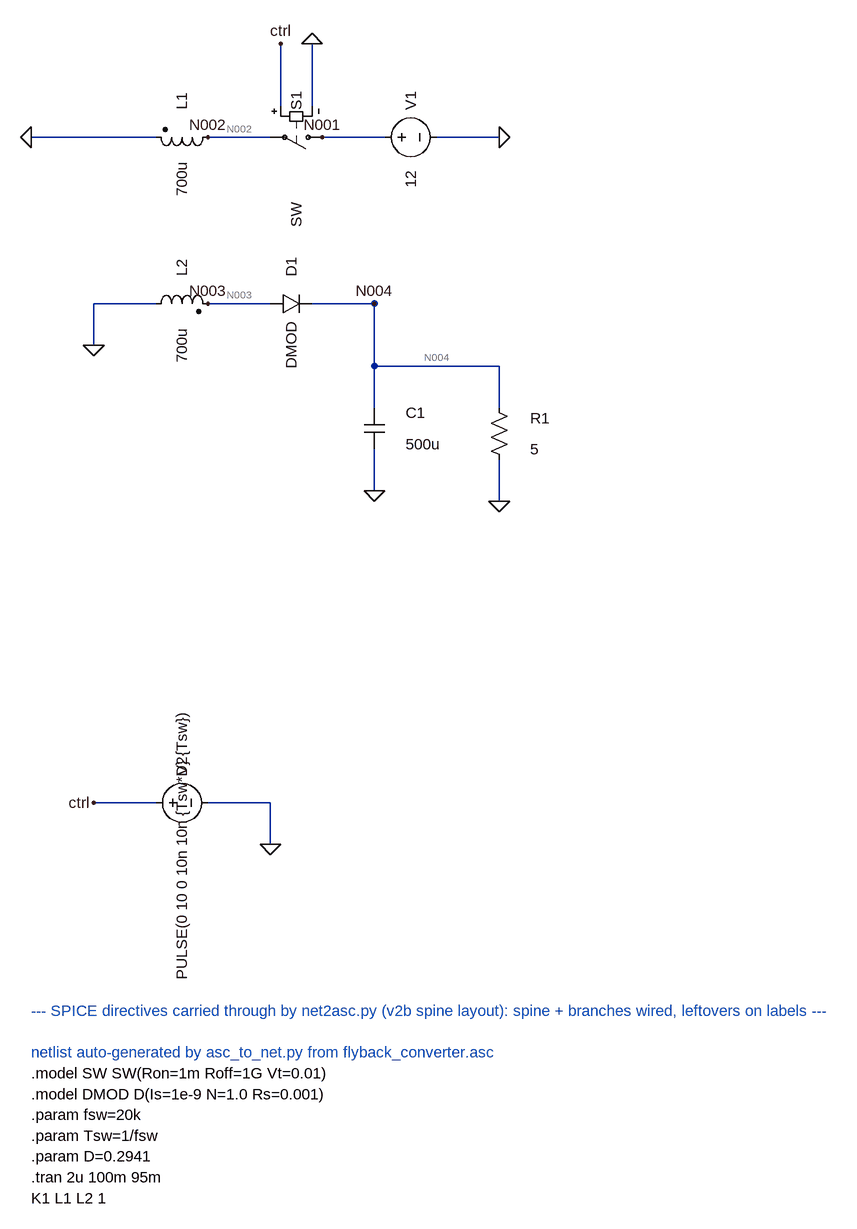
[diagram p0: schematic flyback_converter.asc]
flyback_converter.asc, the LTspice schematic file:
Version 4
SHEET 1 2080 2032
WIRE 160 464 160 528
WIRE 160 464 256 464
WIRE 336 464 432 464
WIRE 496 464 592 464
WIRE 592 464 592 560
WIRE 592 560 592 624
WIRE 592 688 592 752
WIRE 592 464 592 560
WIRE 592 560 784 560
WIRE 784 560 784 624
WIRE 784 704 784 768
WIRE 64 208 160 208
WIRE 160 208 256 208
WIRE 336 208 432 208
WIRE 512 208 608 208
WIRE 448 160 448 64
WIRE 496 160 496 64
WIRE 688 208 784 208
WIRE 160 1232 256 1232
WIRE 336 1232 432 1232
WIRE 432 1232 432 1296
FLAG 160 528 0
FLAG 592 464 N004
FLAG 592 752 0
FLAG 784 768 0
FLAG 64 208 0
FLAG 448 64 ctrl
FLAG 496 64 0
FLAG 784 208 0
FLAG 160 1232 ctrl
FLAG 432 1296 0
FLAG 512 208 N001
FLAG 336 208 N002
FLAG 336 464 N003
SYMBOL ind2 240 480 R270
WINDOW 0 72 56 Center 2
WINDOW 3 -48 56 Center 2
SYMATTR InstName L2
SYMATTR Value 700u
SYMBOL diode 432 480 R270
WINDOW 0 72 32 Center 2
WINDOW 3 -48 32 Center 2
SYMATTR InstName D1
SYMATTR Value DMOD
SYMBOL cap 576 624 R0
WINDOW 0 64 8 Left 2
WINDOW 3 64 56 Left 2
SYMATTR InstName C1
SYMATTR Value 500u
SYMBOL res 768 608 R0
WINDOW 0 64 32 Left 2
WINDOW 3 64 80 Left 2
SYMATTR InstName R1
SYMATTR Value 5
SYMBOL ind2 352 192 R90
WINDOW 0 -40 56 Center 2
WINDOW 3 80 56 Center 2
SYMATTR InstName L1
SYMATTR Value 700u
SYMBOL sw 528 208 R90
WINDOW 0 -56 56 Center 2
WINDOW 3 120 56 Center 2
SYMATTR InstName S1
SYMATTR Value SW
SYMBOL voltage 592 208 R270
WINDOW 0 56 56 Center 2
WINDOW 3 -64 56 Center 2
SYMATTR InstName V1
SYMATTR Value 12
SYMBOL voltage 240 1232 R270
WINDOW 0 56 56 Center 2
WINDOW 3 -64 56 Center 2
SYMATTR InstName V2
SYMATTR Value PULSE(0 10 0 10n 10n {Tsw*D} {Tsw})
TEXT 64 1552 Left 2 ;--- SPICE directives carried through by net2asc.py (v2b spine layout): spine + branches wired, leftovers on labels ---
TEXT 64 1616 Left 2 ;netlist auto-generated by asc_to_net.py from flyback_converter.asc
TEXT 64 1648 Left 2 !.model SW SW(Ron=1m Roff=1G Vt=0.01)
TEXT 64 1680 Left 2 !.model DMOD D(Is=1e-9 N=1.0 Rs=0.001)
TEXT 64 1712 Left 2 !.param fsw=20k
TEXT 64 1744 Left 2 !.param Tsw=1/fsw
TEXT 64 1776 Left 2 !.param D=0.2941
TEXT 64 1808 Left 2 !.tran 2u 100m 95m
TEXT 64 1840 Left 2 !K1 L1 L2 1

The netlist it stands for:
* flyback_converter.asc
L2 0 N003 700u
D1 N003 N004 DMOD
C1 N004 0 500u
R1 N004 0 5
L1 N002 0 700u
S1 N001 N002 ctrl 0 SW
V1 N001 0 12
V2 ctrl 0 PULSE(0 10 0 10n 10n {Tsw*D} {Tsw})
.model D D
.lib standard.dio
* --- SPICE directives carried through by net2asc.py (v2b spine layout): spine + branches wired, leftovers on labels ---
* netlist auto-generated by asc_to_net.py from flyback_converter.asc
.model SW SW(Ron=1m Roff=1G Vt=0.01)
.model DMOD D(Is=1e-9 N=1.0 Rs=0.001)
.param fsw=20k
.param Tsw=1/fsw
.param D=0.2941
.tran 2u 100m 95m
K1 L1 L2 1
.backanno
.end

* Results of the author's LTspice run, read from the files saved beside the schematic
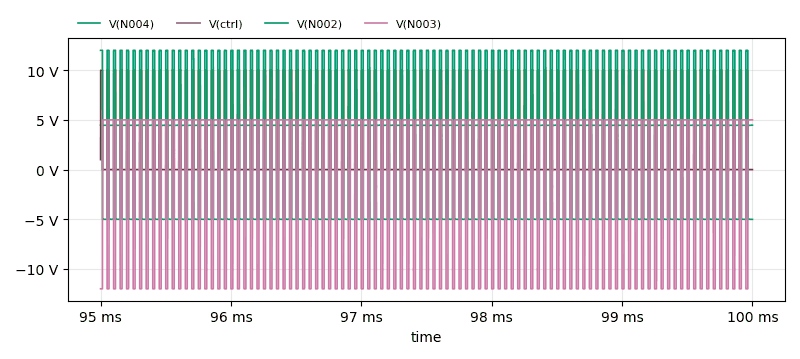
[diagram p1: Transient Analysis of flyback_converter.asc, plotted from the saved traces]
* Transient Analysis, 1 run:
*   V(N004): min 4.446 V, max 4.472 V, average 4.46 V, rms 4.46 V, last 4.472 V
*   V(ctrl): min 0 V, max 10 V, average 2.953 V, rms 5.434 V, last 0 V
*   V(N002): min -5.012 V, max 12 V, average 16.89 mV, rms 7.756 V, last -5.012 V
*   V(N003): min -12 V, max 5.012 V, average -16.89 mV, rms 7.756 V, last 5.012 V